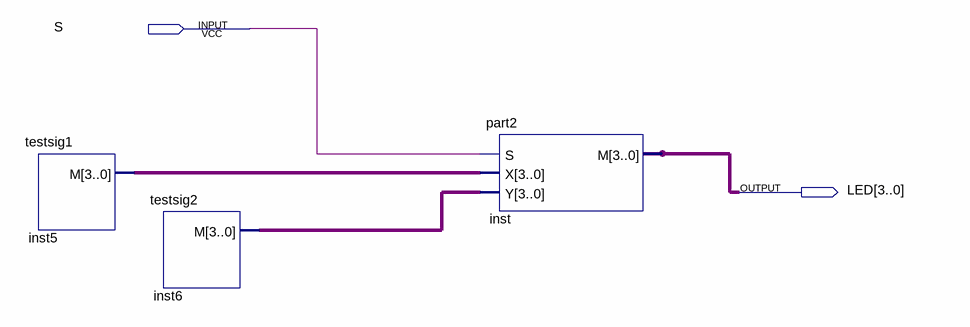
[diagram p0: schematic sheet]
// Quartus schematic part2test.bdf as structural Verilog: 3 symbols, 2 pins
module part2test (
  input  S,
  output [3:0] LED
);

  wire [3:0] inst5_m, inst6_m;

  testsig1 inst5 (.M(inst5_m));
  testsig2 inst6 (.M(inst6_m));
  part2 inst (.S(S), .X(inst5_m), .Y(inst6_m), .M(LED));
endmodule
